# Altium project Setback.PrjPcb
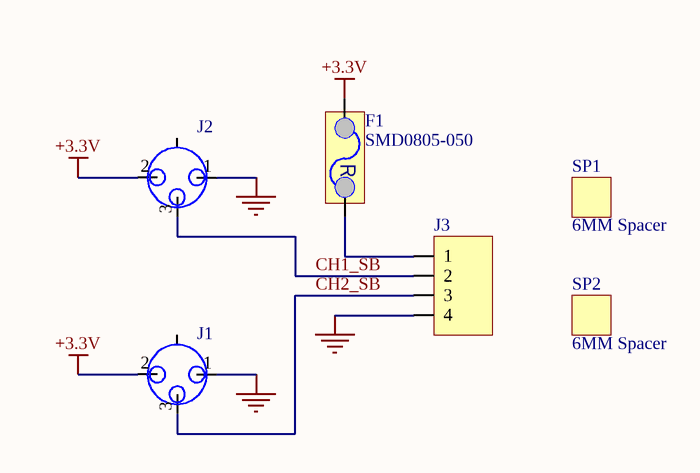
[diagram p0: Setback.SchDoc]
1 sheet, 6 parts. Net scope: global (net labels, ports and power ports of the same name join across sheets).
Board file: Setback.PcbDoc

## Sheet Setback.SchDoc
size A4

### Parts
F1  SMD0805-050  [SMD0805-050]
J1  DIN-MINI-3-Pin  [MIN-DIN-3-pin-socket]  (value not drawn)
J2  DIN-MINI-3-Pin  [MIN-DIN-3-pin-socket]  (value not drawn)
J3  JST XH Connector, 4-Pin  [jst-b4b-xh-ax]  (value not drawn)
SP1  6MM Spacer  [Spacer-2mm dia x 6mm]
SP2  6MM Spacer  [Spacer-2mm dia x 6mm]

### Nets
+3.3V: F1.1 J1.2 J2.2
GND: J1.1 J2.1 J3.4
CH1_SB: J2.3 J3.2
CH2_SB: J1.3 J3.3
NetF1_2: F1.2 J3.1

Not connected (* = marked no-connect by the designer): J1 SH; J2 SH

### Notes on the sheet
- (in symbol SMD0805-050) R

### Library data of the parts
F1 = SMD0805-050: PTC Resetable Fuse 0805 0.5A hold; LCSC: C66452
J3 = JST-B4B-XH-A: LatestRevisionDate: 17-Jul-2002; LatestRevisionNote: Re-released for DXP Platform.; Publisher: Altium Limited; LCSC: *; Farnell PN: 1516278; Digikey: 455-2249-ND
SP1 SP2 = Spacer-6mm